# EAGLE design MicroTeleinfo-V1.0 (EAGLE 6.6.0)
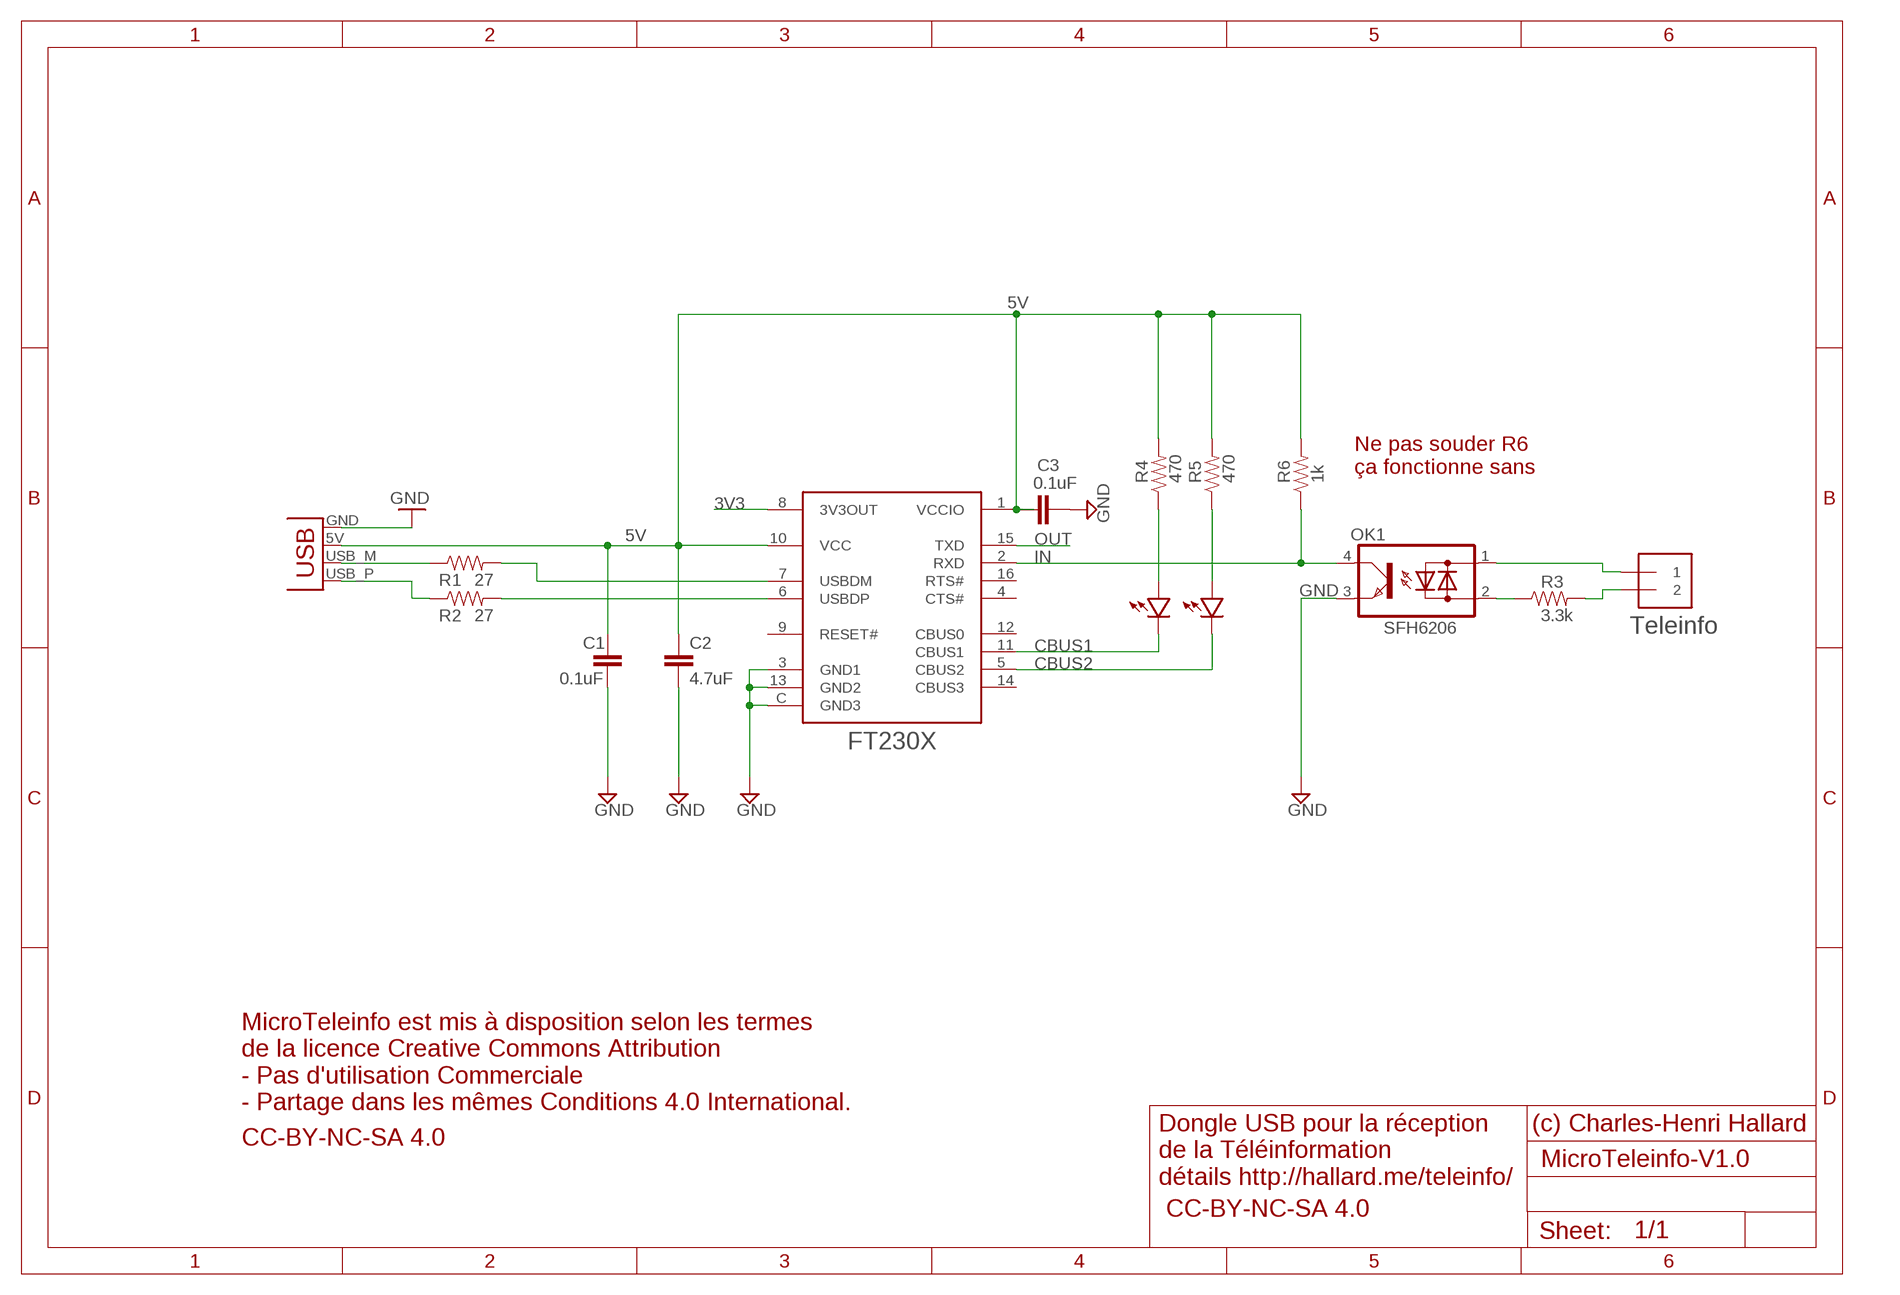
[diagram p0: schematic, sheet 1]

## Parts
C1  0.1uF  CAP0603-CAP  [0603-CAP]
C2  4.7uF  CAP0805-CAP  [0805-CAP]
C3  0.1uF  CAP0603-CAP  [0603-CAP]
FT230X  SERIAL_FT230XQ  [SERIAL_QFN4X4-16]
LED1  Green  LED0805  [0805-LED]
LED2  Red  LED0805  [0805-LED]
OK1  SFH6206  [DIL4-SMD]
R1  27  RESISTOR0603-RES  [0603-RES]
R2  27  RESISTOR0603-RES  [0603-RES]
R3  3.3k  RESISTOR0805-RES  [0805-RES]
R4  470  RESISTOR0603-RES  [0603-RES]
R5  470  RESISTOR0603-RES  [0603-RES]
R6  1k  RESISTOR0603-RES  [0603-RES]
TELEINFO  1X2-3.5MM  [1X2-3.5MM]
X1  USBPCB  [USB-A-PCB]

## Nets
3V3: FT230X.8(3V3OUT)
5V [power]: C1.1 C2.1 C3.1 FT230X.1(VCCIO) FT230X.10(VCC) R4.2 R5.2 R6.2 X1.5V(VBUS)
CBUS1: FT230X.11(CBUS1) LED1.MINUS
CBUS2: FT230X.5(CBUS2) LED2.MINUS
D+: R2.1 X1.USB_P(D+)
GND: C1.2 C2.2 C3.2 FT230X.3(GND1) FT230X.13(GND2) FT230X.C(GND3) OK1.3(E) X1.GND
IN: FT230X.2(RXD) OK1.4(C) R6.1
N$2: R1.1 X1.USB_M(D-)
N$3: OK1.2(AC2) R3.1
N$4: OK1.1(AC1) TELEINFO.1
N$5: R3.2 TELEINFO.2
N$6: LED1.PLUS R4.1
N$7: LED2.PLUS R5.1
OUT: FT230X.15(TXD)
USBDM: FT230X.7(USBDM) R1.2
USBDP: FT230X.6(USBDP) R2.2
Unconnected: FT230X.4(CTS#) FT230X.9(RESET#) FT230X.12(CBUS0) FT230X.14(CBUS3) FT230X.16(RTS#)

## Notes on the sheet
- Ne pas souder R6
  ça fonctionne sans
- Teleinfo
- MicroTeleinfo est mis à disposition selon les termes
  de la licence Creative Commons Attribution
  - Pas d'utilisation Commerciale 
  - Partage dans les mêmes Conditions 4.0 International.
- (c) Charles-Henri Hallard
- CC-BY-NC-SA 4.0
- Dongle USB pour la réception
  de la Téléinformation
  détails http://hallard.me/teleinfo/
- CC-BY-NC-SA 4.0

## Library data of the parts
C1 C3 = LowPowerLab:CAP: Capacitor Standard 0603 ceramic capacitor, and 0.1" leaded capacitor.
C2 = _c2h:CAP: Capacitor Standard 0603 ceramic capacitor, and 0.1" leaded capacitor.
FT230X = _c2h:SERIAL_FT230XQ
LED1 LED2 = LowPowerLab:LED
OK1 = optocoupler:SFH620: Optocoupler, Phototransistor Output, AC Input Source: http://www.vishay.com/docs/83675/sfh620.pdf; MF: VISHAY/TELEFUNKEN; MPN: SFH6206-3; OC_FARNELL: 1469585; OC_NEWARK: 58K2214
R1 R2 R4-R6 = LowPowerLab:RESISTOR: Resistor Basic schematic elements and footprints for 0603, 1206, and PTH resistors.
R3 = _c2h:RESISTOR: Resistor Basic schematic elements and footprints for 0603, 1206, and PTH resistors.
TELEINFO = adafruit:1X2: 3.5mm Terminal block http://www.ladyada.net/library/pcb/eaglelibrary.html
X1 = SparkFun:USB: USB Connectors USB-B-PTH is fully proven SKU : PRT-00139 USB-miniB is fully proven SKU : PRT-00587 USB-A-PCB is untested. USB-A-H is throughly reviewed, but untested. Spark Fun Electronics SKU : PRT-00437 USB-B-SMT is throughly reviewed, but untested. Needs silkscreen touching up. USB-A-S has not been used/tested USB-MB-H has not been used/tested

## Net classes
1 power: width 0.305 mm

## Board
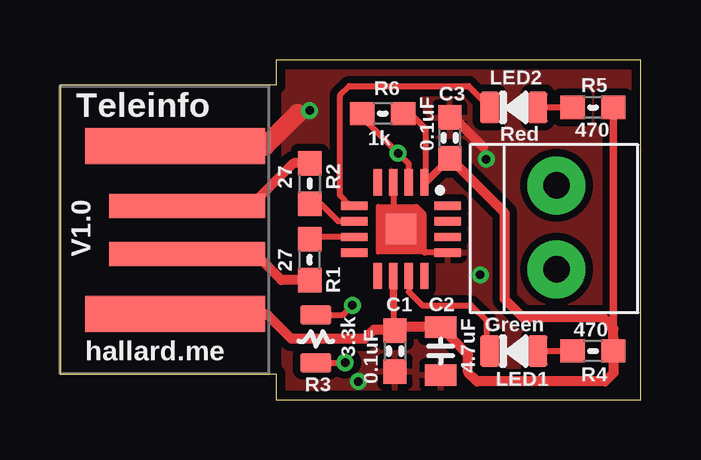
[diagram p1: board, top side]
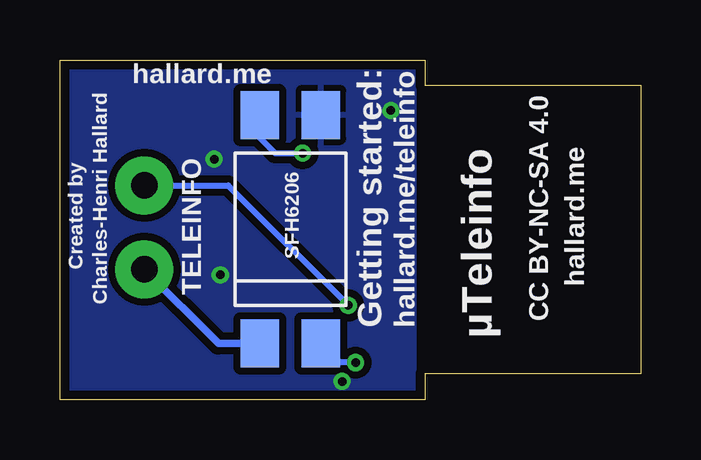
[diagram p2: board, bottom side, seen from below]

Size 24.21 x 14.17 mm. Coordinates in mm from the lower left corner, seen from the top.
Outline: 0,1.09 9,1.09 9,0 24.21,0 24.21,14.17 9,14.17 9,13.12 0,13.12 0,1.09
Copper layers (1*16): Top 0.0356mm / dielectric 1.5011mm / Bottom 0.0356mm
Design rules "default": minimum track width 8mil, minimum drill 13mil, track to track 12mil, track to pad 12mil, pad to pad 12mil, via to via 12mil, smd to smd 8mil, copper to edge 15mil, drill to drill 12mil, minimum pad ring 7mil, minimum via ring 7mil, stop-mask expansion 4mil, vias tented up to drill 25mil, thermal gap 10mil

### Footprints (pad centres in the part's own frame; a part is rotated, then mirrored left to right if it is on the bottom)
0603-CAP = smd 1.016 x 0.965: 1 -0.85,0; 2 0.85,0
0805-CAP = smd 0.902 x 1.3: 1 -1,0; 2 1,0
SERIAL_QFN4X4-16 = smd 1.1 x 0.35: 1 -1.95,0.975; 2 -1.95,0.325; 3 -1.95,-0.325; 4 -1.95,-0.975; 9 1.95,-0.975; 10 1.95,-0.325; 11 1.95,0.325; 12 1.95,0.975 | smd 0.35 x 1.1: 5 -0.975,-1.95; 6 -0.325,-1.95; 7 0.325,-1.95; 8 0.975,-1.95; 13 0.975,1.95; 14 0.325,1.95; 15 -0.325,1.95; 16 -0.975,1.95 | smd 1.27 x 1.27: C 0,0
0805-LED = smd 0.8 x 1.3: MINUS -1,0; PLUS 1,0
DIL4-SMD = smd 1.6 x 2: 1 -1.27,-4.77; 2 1.27,-4.77; 3 1.27,4.77; 4 -1.27,4.77
0603-RES = smd 1.016 x 0.965: 1 -0.85,0; 2 0.85,0
0805-RES = smd 0.8 x 1.3: 1 -1,0; 2 1,0
1X2-3.5MM = drill 1.1 pad 2.413: 1 1.8,0; 2 -1.7,0
USB-A-PCB = smd 7.5 x 1.5: 5V -0.2,-3.5; GND -0.2,3.5 | smd 6.5 x 1: USB_M 0.3,-1; USB_P 0.3,1

### Placement (x,y rotation side)
C1  13.97,2.03 270 top
C2  15.88,2.03 270 top
C3  16.26,10.92 90 top
FT230X  14.22,7.11 270 top
LED1  18.92,2.03 0 top
LED2  18.92,12.19 0 top
OK1  14.61,7.11 0 bottom
R1  10.41,5.84 90 top
R2  10.41,9.02 270 top
R3  10.67,2.54 90 top
R4  22.23,2.03 0 top
R5  22.23,12.19 0 top
R6  13.46,11.94 0 top
TELEINFO  20.7,7.24 270 top
X1  5,7.09 0 top

### Tracks (layer width: path | path; a pad name or v marks a point on that pad's centre or on a via)
5V
  Top 0.254: 13.9,3.84 13.9,2.95 C1.1 | R6.2 14.61,11.94 15.24,11.3 15.24,9.1 FT230X.1
  Top 0.305: FT230X.10 13.9,3.84 | 16.47,10.07 C3.1 15.25,9.06 FT230X.1 | R5.2 23.07,2.54
  Top 0.406: X1.5V 4.83,3.56 8.64,3.56 9.65,2.54 12.7,2.54 13.08,2.92 13.93,2.92 C1.1 14.12,3.03 C2.1 17.02,1.87 17.02,1.14 17.4,0.76 22.73,0.76 23.07,1.1 R4.2 23.07,2.54 23.07,2.96 22.61,3.43 19.3,3.43 18.54,4.19 18.54,7.79 C3.1
CBUS1
  Top 0.254: FT230X.11 14.55,4.5 15.11,3.94 17.14,3.94 17.78,3.3 17.78,1.92 LED1.MINUS
CBUS2
  Top 0.254: 18.16,12.19 LED2.MINUS 17.03,13.08 12.06,13.08 11.68,12.7 11.68,8.51 12.06,8.13 12.32,8.13 FT230X.5
D+
  Top 0.406: R2.1 9.74,9.87 7.87,8 5.39,8 X1.USB_P
GND  (via drill 0.36 pad 0.71)
  Top 0.254: FT230X.3 13.9,7.44 | FT230X.13 15.2,6.14 FT230X.C
  Top 0.305: 13.9,7.44 FT230X.C
  Top 0.406: C3.2 16.42,11.77 17.65,10.54
  Top 0.813: X1.GND 8.55,10.59 9.91,11.94
  other vias: 10.41,12.06 12.45,0.76 17.53,5.21 17.78,10.03
  pour Top: 9.27,15.24 24.77,15.24 24.77,-0.63 9.27,-0.63
  pour Bottom: 9.4,14.73 24.51,14.73 24.51,-0.63 9.4,-0.63
IN  (via drill 0.36 pad 0.71)
  Top 0.254: FT230X.2 14.55,9.83 v14.1,10.29 12.61,11.77 R6.1
  Bottom 0.254: OK1.4 15.88,10.92 15.24,10.29 v14.1,10.29
N$2
  Top 0.406: R1.1 9.23,4.99 8.13,6.1 X1.USB_M
N$3  (via drill 0.36 pad 0.71)
  Top 0.254: R3.1 11.88,1.54 v11.89,1.55
  Bottom 0.254: v11.89,1.55 12.54,1.55 OK1.2
N$4
  Bottom 0.305: OK1.1 17.6,2.34 TELEINFO.1
N$5  (via drill 0.36 pad 0.71)
  Top 0.254: R3.2 11.79,3.54 v12.19,3.94
  Bottom 0.254: TELEINFO.2 17.19,8.94 v12.19,3.94
N$6
  Top 0.254: LED1.PLUS R4.1
N$7
  Top 0.254: R5.1 LED2.PLUS
USBDM
  Top 0.254: FT230X.7 10.51,6.79 R1.2
USBDP
  Top 0.254: FT230X.6 11.61,7.44 10.92,8.13 10.45,8.13 R2.2

### Text on the board
tPlace: V1.0
bPlace: hallard.me/teleinfo | Getting started: | hallard.me | Charles-Henri Hallard | Created by
tNames: Teleinfo | hallard.me
bNames: CC BY-NC-SA 4.0 | hallard.me | µTeleinfo